# Altium schematic sheet MainBoard_PSU.SchDoc
size A
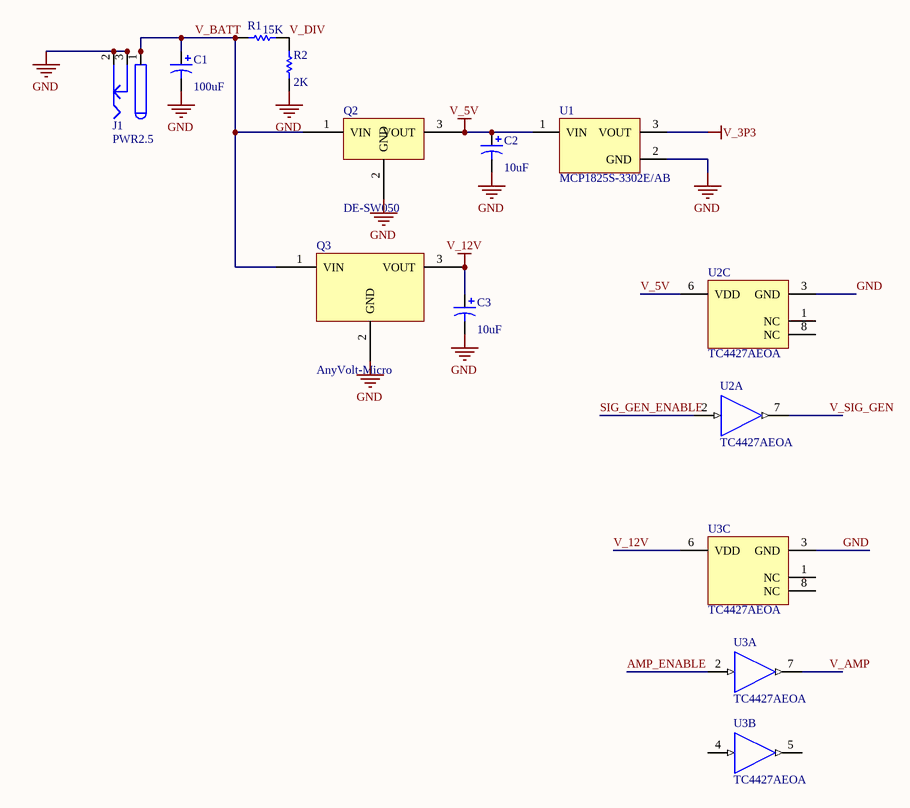
[diagram p0: MainBoard_PSU.SchDoc]

## Parts
C1  value 100uF  [CAPPR2-5x6.8]  (hidden comment: Cap Pol1)
C2  value 10uF  [CAPPR2-5x6.8]  (hidden comment: Cap Pol1)
C3  value 10uF  [CAPPR2-5x6.8]  (hidden comment: Cap Pol1)
J1  PWR2.5  [KLD-0202]
Q2  DE-SW050  [TO-220]
Q3  AnyVolt-Micro  [TO-220]
R1  value 15K  [AXIAL-0.3]  (hidden comment: Res1)
R2  value 2K  [AXIAL-0.3]  (hidden comment: Res1)
U1  MCP1825S-3302E/AB  [TO-220-AB3]
U2  TC4427AEOA  [SOIC-OA8_N]  (parts A,C of 3)
U3  TC4427AEOA  [SOIC-OA8_N]  (parts A,B,C of 3)

## Nets
GND: C1.2 C2.2 C3.2 J1.2 J1.2A J1.2B J1.3 J1.3A J1.3B Q2.2(GND) Q3.2(GND) R2.1 U1.2(GND) U2.3(GND) U3.3(GND)
V_3P3: U1.3(VOUT)
V_5V: C2.1 Q2.3(VOUT) U1.1(VIN) U2.6(VDD)
V_12V: C3.1 Q3.3(VOUT) U3.6(VDD)
AMP_ENABLE: U3.2(INA)
SIG_GEN_ENABLE: U2.2(INA)
V_AMP: U3.7(OUTA)
V_BATT: C1.1 J1.1 J1.1A J1.1B Q2.1(VIN) Q3.1(VIN) R1.1
V_DIV: R1.2 R2.2
V_SIG_GEN: U2.7(OUTA)

Not connected (* = marked no-connect by the designer): U2 1(NC) 8(NC); U3 1(NC) 4(INB) 5(OUTB) 8(NC)

## Library data of the parts
C1-C3 = Cap Pol1: Polarized Capacitor (Radial); Published: 8-Jun-2000; LatestRevisionDate: 17-Jul-2002; LatestRevisionNote: Re-released for DXP Platform.; PackageReference: RB7.6-15; Publisher: Altium Limited
J1 = PWR2.5: Low Voltage Power Supply Connector; Published: 17-Dec-2003; DatasheetDocument: 09-May-2002; Publisher: Altium Limited; ComponentLink1Description: Manufacturer Link; ComponentLink1URL: http://domino.kycon.com/internet/Products.html
R1 R2 = Res1: Resistor; Published: 8-Jun-2000; LatestRevisionDate: 17-Jul-2002; LatestRevisionNote: Re-released for DXP Platform.; PackageReference: AXIAL-0.3; Publisher: Altium Limited
U1 = MCP1825S-3302E/AB: 500 mA, Low Voltage, Low Quiescent Current LDO Regulator, 3-Pin TO-220, Extended Temperature; FirstPublished: 29-Jan-2009; DatasheetVersion: revB, Feb-2008; PackageVersion: revBB, Aug-2009; PackageReference: TO-220-AB3; Publisher: Altium Limited; PackageDescription: 3-Lead Plastic Transistor Outline (AB) [TO-220]; Supplier 1: Digi-Key; Supplier Part Number 1: MCP1825S-3302E/AB-ND; Supplier 2: Farnell; Supplier Part Number 2: 1578403; Supplier 3: Newark; Supplier Part Number 3: 26M9960; ComponentLink1Description: Datasheet; ComponentLink1URL: http://ww1.microchip.com/downloads/en/DeviceDoc/22056b.pdf; ComponentLink2Description: Packaging Specification; ComponentLink2URL: http://www.microchip.com/stellent/groups/techpub_sg/documents/packagingspec/en012702.pdf; ComponentLink3Description: Microchip.com Home; ComponentLink3URL: http://www.microchip.com/
U2 U3 = TC4427AEOA: 1.5A Dual High-Speed Power MOSFET Driver, Non-Inverting, Industrial Temperature; FirstPublished: 29-Jan-2009; DatasheetVersion: revF, Jan-2006; PackageVersion: revBB, Aug-2009; PackageReference: SOIC-OA8; Publisher: Altium Limited; PackageDescription: 8-Lead Plastic Small Outline (OA) - Narrow, 3.90mm Body [SOIC]; Supplier 1: Digi-Key; Supplier Part Number 1: TC4427AEOA-ND; Supplier 2: Farnell; Supplier Part Number 2: 1292285; Supplier 3: Newark; Supplier Part Number 3: 96K4020; Code_IPC: SOIC127P600-8; ComponentLink1Description: Datasheet; ComponentLink1URL: http://ww1.microchip.com/downloads/en/DeviceDoc/21423F.pdf; ComponentLink2Description: Packaging Specification; ComponentLink2URL: http://www.microchip.com/stellent/groups/techpub_sg/documents/packagingspec/en012702.pdf; ComponentLink3Description: Microchip.com Home; ComponentLink3URL: http://www.microchip.com/